# Altium schematic sheet MCU.SchDoc: MVU
size A3; DocumentNumber: 4; SheetNumber: 4; SheetTotal: 6
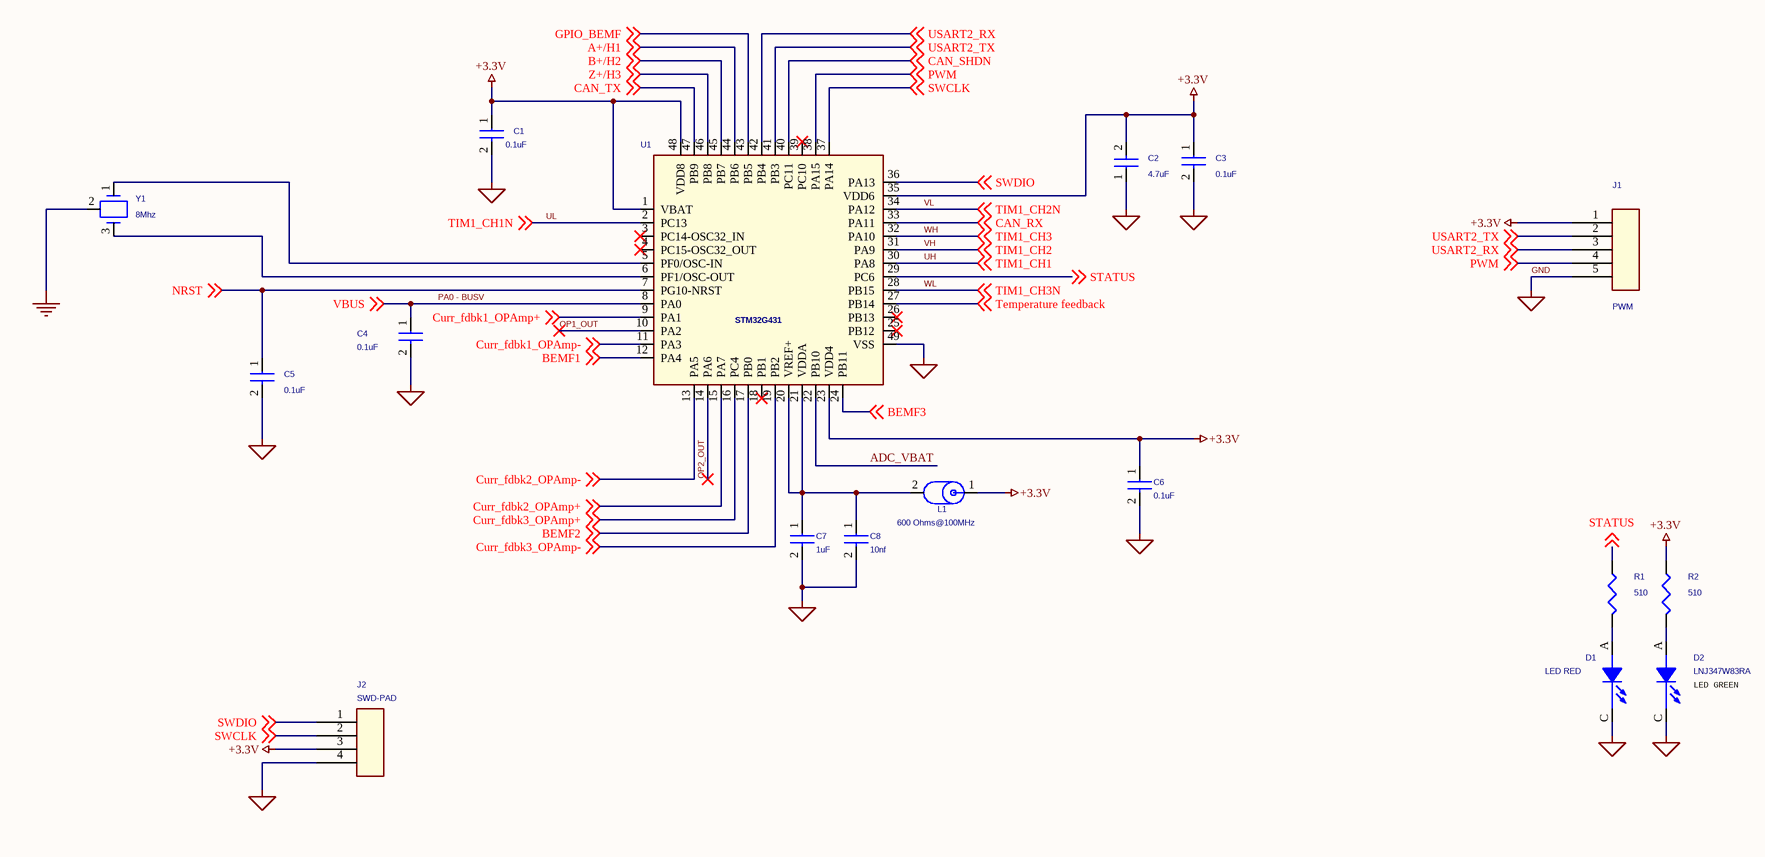
[diagram p0: MCU.SchDoc]

## Parts
C1  0.1uF  [C_0402]
C2  4.7uF  [C_0603]
C3  0.1uF  [C_0402]
C4  0.1uF  [C_0402]
C5  0.1uF  [C_0402]
C6  0.1uF  [C_0402]
C7  1uF  [C_0402]
C8  10nf  [C_0402]
D1  LED RED  [D_0402_Led_red]
D2  LNJ347W83RA  [D_0402_Led_green]
J1  PWM  [SOLDER_PAD_5PIN_SMD]
J2  SWD-PAD  [SOLDER_PAD_4PIN_rect_SMD]
L1  600 Ohms@100MHz  [L_0402]
R1  510  [R_0402]
R2  510  [R_0402]
U1  STM32G431  [qfn49p50_700x700x60l40x25t560n]
Y1  8Mhz  [murata_cstce8m00g15c99-r0]

## Nets
+3.3V: C1.1 C2.2 C3.1 C6.1 J1.1 J2.3 L1.1 R2.1 U1.1(VBAT) U1.23(VDD4) U1.35(VDD6) U1.48(VDD8)
GND: C1.2 C2.1 C3.2 C4.2 C5.2 C6.2 C7.2 C8.2 D1.C(CATHODE) D2.C(CATHODE) J1.5 J2.4 U1.49(VSS) Y1.2  [also labelled GND_SIGNAL]
A+/H1: U1.44(PB6) ; off-sheet A+/H1
ADC_VBAT: U1.22(PB10)
B+/H2: U1.45(PB7) ; off-sheet B+/H2
BEMF1: U1.12(PA4) ; off-sheet BEMF1
BEMF2: U1.17(PB0) ; off-sheet BEMF2
BEMF3: U1.24(PB11) ; off-sheet BEMF3
CAN_RX: U1.33(PA11) ; off-sheet CAN_RX
CAN_SHDN: U1.40(PC11) ; off-sheet CAN_SHDN
CAN_TX: U1.47(PB9) ; off-sheet CAN_TX
Curr_fdbk1_OPAmp+: U1.9(PA1) ; off-sheet Curr_fdbk1_OPAmp+
Curr_fdbk1_OPAmp-: U1.11(PA3) ; off-sheet Curr_fdbk1_OPAmp-
Curr_fdbk2_OPAmp+: U1.15(PA7) ; off-sheet Curr_fdbk2_OPAmp+
Curr_fdbk2_OPAmp-: U1.13(PA5) ; off-sheet Curr_fdbk2_OPAmp-
Curr_fdbk3_OPAmp+: U1.16(PC4) ; off-sheet Curr_fdbk3_OPAmp+
Curr_fdbk3_OPAmp-: U1.19(PB2) ; off-sheet Curr_fdbk3_OPAmp-
GPIO_BEMF: U1.43(PB5) ; off-sheet GPIO_BEMF
NRST: C5.1 U1.7(PG10-NRST) ; off-sheet NRST
OP1_OUT: U1.10(PA2)
OP2_OUT: U1.14(PA6)
PA0 - BUSV: C4.1 U1.8(PA0) ; off-sheet VBUS  [also labelled VBUS]
PWM: J1.4 U1.38(PA15) ; off-sheet PWM
STATUS: R1.1 U1.29(PC6) ; off-sheet STATUS
SWCLK: J2.2 U1.37(PA14) ; off-sheet SWCLK
SWDIO: J2.1 U1.36(PA13) ; off-sheet SWDIO
Temperature feedback: U1.27(PB14) ; off-sheet Temperature feedback
UH: U1.30(PA8) ; off-sheet TIM1_CH1  [also labelled TIM1_CH1]
UL: U1.2(PC13) ; off-sheet TIM1_CH1N  [also labelled TIM1_CH1N]
USART2_RX: J1.3 U1.42(PB4) ; off-sheet USART2_RX
USART2_TX: J1.2 U1.41(PB3) ; off-sheet USART2_TX
VH: U1.31(PA9) ; off-sheet TIM1_CH2  [also labelled TIM1_CH2]
VL: U1.34(PA12) ; off-sheet TIM1_CH2N  [also labelled TIM1_CH2N]
WH: U1.32(PA10) ; off-sheet TIM1_CH3  [also labelled TIM1_CH3]
WL: U1.28(PB15) ; off-sheet TIM1_CH3N  [also labelled TIM1_CH3N]
Z+/H3: U1.46(PB8) ; off-sheet Z+/H3
NetC7_1: C7.1 C8.1 L1.2 U1.20(VREF+) U1.21(VDDA)
NetD1_A: D1.A(ANODE) R1.2
NetD2_A: D2.A(ANODE) R2.2
NetU1_5: U1.5(PF0/OSC-IN) Y1.1
NetU1_6: U1.6(PF1/OSC-OUT) Y1.3

Not connected (* = marked no-connect by the designer): U1 3(PC14-OSC32_IN)* 4(PC15-OSC32_OUT)* 18(PB1)* 25(PB12)* 26(PB13)* 39(PC10)*

## Notes on the sheet
- (near D2) LED GREEN
- Title:
- Project:
- Size:
- Revision:
- Variant:
- A3
- -
- Date:
- Reference:
- Sheet:
- of

## Library data of the parts
C1 = CAP_Dup1: CAP CER 0.1UF 16V X7R 0402; PART_NUMBER: CAP-00000053; Manufacturer: Wurth Electronics Inc.; Manufacturer PN: 885012205037; Dielectric Type: Capacitors; Tolerance: 10%; CLASS: DISCRETE; Package Size: 0402 (1005 Metric); Temperature Coefficient: X7R; Rated Voltage: 16V
C2 = CAP_Dup1: CAP CER 4.7UF 10V X5R 0603; Manufacturer PN: 885012106012; Manufacturer: Wurth Electronics Inc.; PART_NUMBER: TMP-414; CLASS: DISCRETE; Tolerance: 20%; Dielectric Type: Capacitors; Rated Voltage: 10V; Temperature Coefficient: X5R; Package Size: 0603 (1608 Metric)
C3-C6 = CAP_Dup1: CAP CER 0.1UF 16V X7R 0402; Manufacturer PN: 885012205037; Manufacturer: Wurth Electronics Inc.; PART_NUMBER: CAP-00000053; CLASS: DISCRETE; Tolerance: 10%; Dielectric Type: Capacitors; Rated Voltage: 16V; Temperature Coefficient: X7R; Package Size: 0402 (1005 Metric)
C7 = CAP_Dup1: CAP CER 1UF 25V X5R 0402; PART_NUMBER: CAP-00000006; Manufacturer: Murata Electronics North America; Manufacturer PN: GRM155R61E105KA12D; Dielectric Type: Capacitors; Tolerance: 10%; CLASS: DISCRETE; Package Size: 0402 (1005 Metric); Temperature Coefficient: X5R; Rated Voltage: 25V
C8 = CAP_Dup1: CAP CER 10000PF 16V X7R 0402; PART_NUMBER: TMP-422; Manufacturer: Wurth Electronics Inc.; Manufacturer PN: 885012205031; Dielectric Type: Capacitors; Tolerance: 10%; CLASS: DISCRETE; Package Size: 0402 (1005 Metric); Temperature Coefficient: X7R; Rated Voltage: 16V
D1 = LED: DIO, Rectangle with Flat Top, 1.00mm x 0.50mm, VLMS1500-GS08, 20mA, --, --, 0402 (1005 Metric); PART_NUMBER: DIO-00000003; Manufacturer: Vishay Semiconductor Opto Division; CLASS: DISCRETE; Package Size: 0402 (1005 Metric); Manufacturer PN: VLMS1500-GS08
D2 = LED: LED GREEN 0402 SMD; PART_NUMBER: TMP-187; Manufacturer: Panasonic Electronic Components; CLASS: DISCRETE; Package Size: 0402 (1005 Metric); Manufacturer PN: LNJ347W83RA
J1 = CON5: SOLDER PADS
J2 = CON4: SOLDER PADS
L1 = IND_FB: FERRITE BEAD 600 OHM 0402 1LN; Manufacturer PN: BLM15BX601SN1D; Manufacturer: Murata Electronics North America; PART_NUMBER: TMP-492; CLASS: DISCRETE; Package Size: 0402 (1005 Metric)
R1 R2 = RES: RES SMD 510 OHM 1% 1/16W 0402; PART_NUMBER: TMP-438; Manufacturer: Yageo; Manufacturer PN: RC0402FR-07510RL; Temperature Coefficient: 100ppm/C; Rated Power: 0.063W, 1/16W; CLASS: DISCRETE; Package Size: 0402 (1005 Metric); Tolerance: 1%
U1 = STM32_LQFP64_6
Y1 = resonator: CER RES 8.0000MHZ 33PF SMD; Manufacturer PN: CSTCE8M00G15C99-R0; Manufacturer: Murata Electronics North America; PART_NUMBER: TMP-382; CLASS: DISCRETE; Frequency Tolerance: 0.1%; Frequency Stability: 0.13%; Package Size: 0.126" L x 0.051" W (3.20mm x 1.30mm)